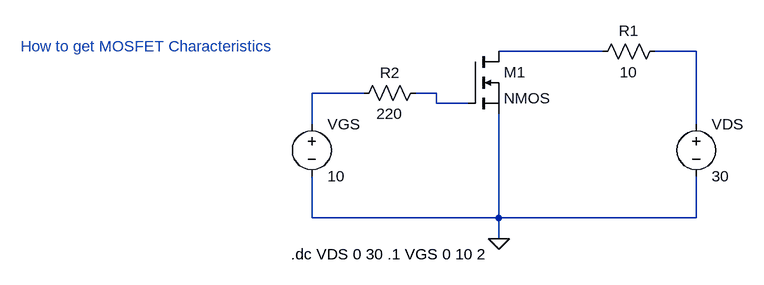
[diagram p0: schematic MOS_Characteristics.asc]
MOS_Characteristics.asc, the LTspice schematic file:
Version 4
SHEET 1 880 680
WIRE 400 96 240 96
WIRE 544 96 480 96
WIRE 32 160 -48 160
WIRE 144 160 112 160
WIRE 144 176 144 160
WIRE 192 176 144 176
WIRE -48 208 -48 160
WIRE 544 208 544 96
WIRE -48 352 -48 288
WIRE 240 352 240 192
WIRE 240 352 -48 352
WIRE 544 352 544 288
WIRE 544 352 240 352
WIRE 240 384 240 352
FLAG 240 384 0
SYMBOL nmos 192 96 R0
SYMATTR InstName M1
SYMBOL res 496 80 R90
WINDOW 0 0 56 VBottom 2
WINDOW 3 32 56 VTop 2
SYMATTR InstName R1
SYMATTR Value 10
SYMBOL res 128 144 R90
WINDOW 0 0 56 VBottom 2
WINDOW 3 32 56 VTop 2
SYMATTR InstName R2
SYMATTR Value 220
SYMBOL voltage -48 192 R0
WINDOW 123 0 0 Left 0
WINDOW 39 0 0 Left 0
SYMATTR InstName VGS
SYMATTR Value 10
SYMBOL voltage 544 192 R0
WINDOW 123 0 0 Left 0
WINDOW 39 0 0 Left 0
SYMATTR InstName VDS
SYMATTR Value 30
TEXT -80 408 Left 2 !.dc VDS 0 30 .1 VGS 0 10 2
TEXT -496 88 Left 2 ;How to get MOSFET Characteristics

The netlist it stands for:
* MOS_Characteristics.asc
M1 N001 N004 0 0 NMOS
R1 N002 N001 10
R2 N004 N003 220
VGS N003 0 10
VDS N002 0 30
.model NMOS NMOS
.model PMOS PMOS
.lib standard.mos
.dc VDS 0 30 .1 VGS 0 10 2
* How to get MOSFET Characteristics
.backanno
.end